# EAGLE schematic usb-i2c-thingy (EAGLE 9.5.0)
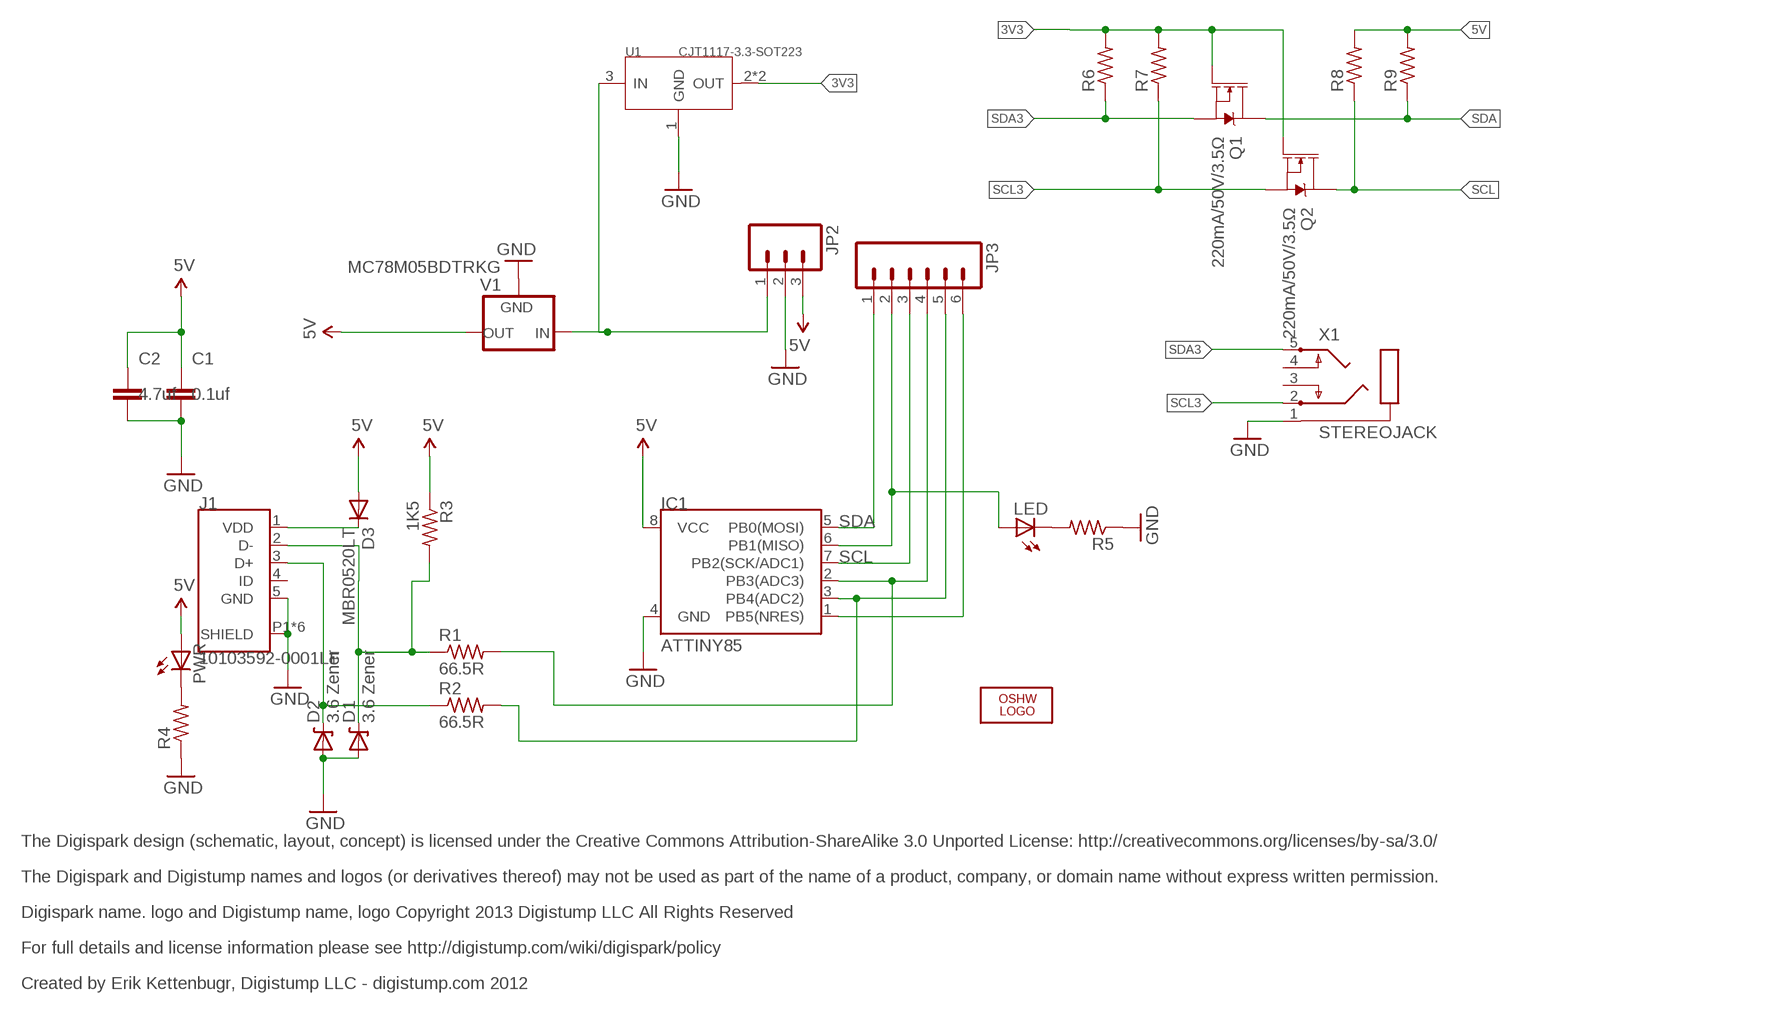
[diagram p0: schematic, sheet 1]

## Parts
C1  0.1uf  C-EUC0603  [C0603]
C2  4.7uf  C-EUC0603  [C0603]
D1  3.6 Zener  DIODE-ZENER-BZT52  [SOD-323]
D2  3.6 Zener  DIODE-ZENER-BZT52  [SOD-323]
D3  MBR0520LT  [SOD123]
IC1  ATTINY85  ATTINY45  [SO08-EIAJ]
J1  10103592-0001LF  [AMPHENOL_10103592-0001LF]
JP2  M03PTH  [1X03]
JP3  M06SIP  [1X06]
LED  LED0603  [LED-0603]
LOGO2  LOGO-OSHW-10MILX0200-NT  [OSHW_10X200_NOTEXT]
PWR  LED0603  [LED-0603]
Q1  220mA/50V/3.5Ω  MOSFET-NCH-BSS138  [SOT23-3]
Q2  220mA/50V/3.5Ω  MOSFET-NCH-BSS138  [SOT23-3]
R1  66.5R  R-US_R0603  [R0603]
R2  66.5R  R-US_R0603  [R0603]
R3  1K5  R-US_R0603  [R0603]
R4  R-US_R0603  [R0603]
R5  R-US_R0603  [R0603]
R6  R-US_R0603  [R0603]
R7  R-US_R0603  [R0603]
R8  R-US_R0603  [R0603]
R9  R-US_R0603  [R0603]
U1  CJT1117-3.3-SOT223  PMIC-CJT1117-3.3(SOT223)  [SOT-223]
V1  MC78M05BDTRKG  LP2950CDT-3.0  [DPACK]
X1  STEREOJACK  [STX3100]

## Nets
3V3: Q1.1(G) Q2.1(G) R6.2 R7.2 U1.2(OUT) U1.TER(OUT)
5V: C1.1 C2.1 D3.A IC1.8(VCC) JP2.3 PWR.A R3.1 R8.2 R9.2 V1.3(OUT)
GND: C1.2 C2.2 D1.2(A) D2.2(A) IC1.4(GND) J1.5(GND) J1.P1(SHIELD) J1.P2(SHIELD) J1.P3(SHIELD) J1.P4(SHIELD) J1.P5(SHIELD) J1.P6(SHIELD) JP2.2 R4.1 R5.1 U1.1(GND) V1.4(GND) X1.1
N$1: IC1.2(PB3(ADC3)) JP3.4 R1.2
N$2: IC1.6(PB1(MISO)) JP3.2 LED.A
N$6: IC1.3(PB4(ADC2)) JP3.5 R2.2
N$8: IC1.1(PB5(NRES)) JP3.6
N$10: D1.1(C) J1.2(D-) R1.1 R3.2
N$11: D2.1(C) J1.3(D+) R2.1
N$12: LED.C R5.2
N$15: JP2.1 U1.3(IN) V1.1(IN)
N$16: D3.C J1.1(VDD)
N$17: PWR.C R4.2
SCL: IC1.7(PB2(SCK/ADC1)) JP3.3 Q2.3(D) R8.1
SCL3: Q2.2(S) R7.1 X1.2
SDA: IC1.5(PB0(MOSI)) JP3.1 Q1.3(D) R9.1
SDA3: Q1.2(S) R6.1 X1.5
Unconnected: J1.4(ID) X1.3 X1.4

## Notes on the sheet
- The Digispark design (schematic, layout, concept) is licensed under the Creative Commons Attribution-ShareAlike 3.0 Unported License: http://creativecommons.org/licenses/by-sa/3.0/
- The Digispark and Digistump names and logos (or derivatives thereof) may not be used as part of the name of a product, company, or domain name without express written permission.
- Digispark name. logo and Digistump name, logo Copyright 2013 Digistump LLC All Rights Reserved
- For full details and license information please see http://digistump.com/wiki/digispark/policy
- Created by Erik Kettenbugr, Digistump LLC - digistump.com 2012

## Library data of the parts
C1 C2 = rcl:C-EU: CAPACITOR, European symbol; SPICEPREFIX: C
D1 D2 = SparkFun:DIODE-ZENER: Zener Diode Production Part - 8199 3.4V Zener Voltage
D3 = diode:MBR0520LT: SCHOTTKY BARRIER RECTIFIER Source: http://onsemi.com .. MBR0520LT1-D.pdf
IC1 = SparkFun:ATTINY45: Atmel ATTiny45
J1 = 10103592-0001LF:10103592-0001LF: Conn Micro USB Type B RCP 5 POS 0.65mm Solder RA SMD 5 Terminal 1 Port T/R; AVAILABILITY: Unavailable; DESCRIPTION: Micro Usb, 2.0 Type b, Rcpt, Smt; MF: Amphenol ICC; MP: 10103592-0001LF; PACKAGE: None; PRICE: None
JP2 = SparkFun:M03: Header 3 Standard 3-pin 0.1" header. Use with straight break away headers (SKU : PRT-00116), right angle break away headers (PRT-00553), swiss pins (PRT-00743), machine pins (PRT-00117), and female headers (PRT-00115). Molex polarized connector foot print use with SKU : PRT-08232 with associated crimp pins and housings.
JP3 = SparkFun:M06: Header 6 Standard 6-pin 0.1" header. Use with straight break away headers (SKU : PRT-00116), right angle break away headers (PRT-00553), swiss pins (PRT-00743), machine pins (PRT-00117), and female headers (PRT-00115). Molex polarized connector foot print use with SKU : PRT-08094 with associated crimp pins and housings. NOTES ON THE VARIANTS LOCK and LOCK_LONGPADS... This footprint was designed to help hold the alignment of a through-hole component (i.e. 6-pin header) while soldering it into place. You may notice that each hole has been shifted either up or down by 0.005 of an inch from it's more standard position (which is a perfectly straight line). This slight alteration caused the pins (the squares in the middle) to touch the edges of the holes. Because they are alternating, it causes a "brace" to hold the component in place. 0.005 has proven to be the perfect amount of "off-center" position when using our standard breakaway headers. Although looks a little odd when you look at the bare footprint, once you have a header in there, the alteration is very hard to notice. Also, if you push a header all the way into place, it is covered up entirely on the bottom side. This idea of altering the position of holes to aid alignment will be further integrated into the Sparkfun Library for other footprints. It can help hold any component with 3 or more connection pins.
LED PWR = SparkFun:LED: LEDs Standard schematic elements and footprints for 5mm, 3mm, 1206, and 0603 sized LEDs. 5mm - Spark Fun Electronics SKU : COM-00529 (and others)
LOGO2 = logo:LOGO-OSHW-10MIL
Q1 Q2 = SparkFun-DiscreteSemi:MOSFET-NCH: N-channel MOSFETs Voltage controlled devices that allow control of high current outputs. SparkFun Products: SparkFun OpenScale <https://www.sparkfun.com/products/13261> SparkFun Digital Sandbox <https://www.sparkfun.com/products/12651> SparkFun Monster Moto Shield <https://www.sparkfun.com/products/10182> SparkFun MOSFET Power Controller <https://www.sparkfun.com/products/11214>; PROD_ID: TRANS-00830
R1-R9 = adafruit:R-US_: RESISTOR, American symbol
U1 = Seeed-IC:PMIC-CJT1117-3.3(SOT223): 310030097; MPN: CJT1117-3.3
V1 = v-reg:LP2950?*: Source: http://cache.national.com/ds/LP/LP2950.pdf
X1 = adafruit:STEREOJACK: MIC/HEADPHONE JACK Stereo jack with two switches. Kycon STX3100, CUI SJ1-3555NG and/or 4UCon 05544